# Altium schematic sheet sensorTest.SchDoc
size B
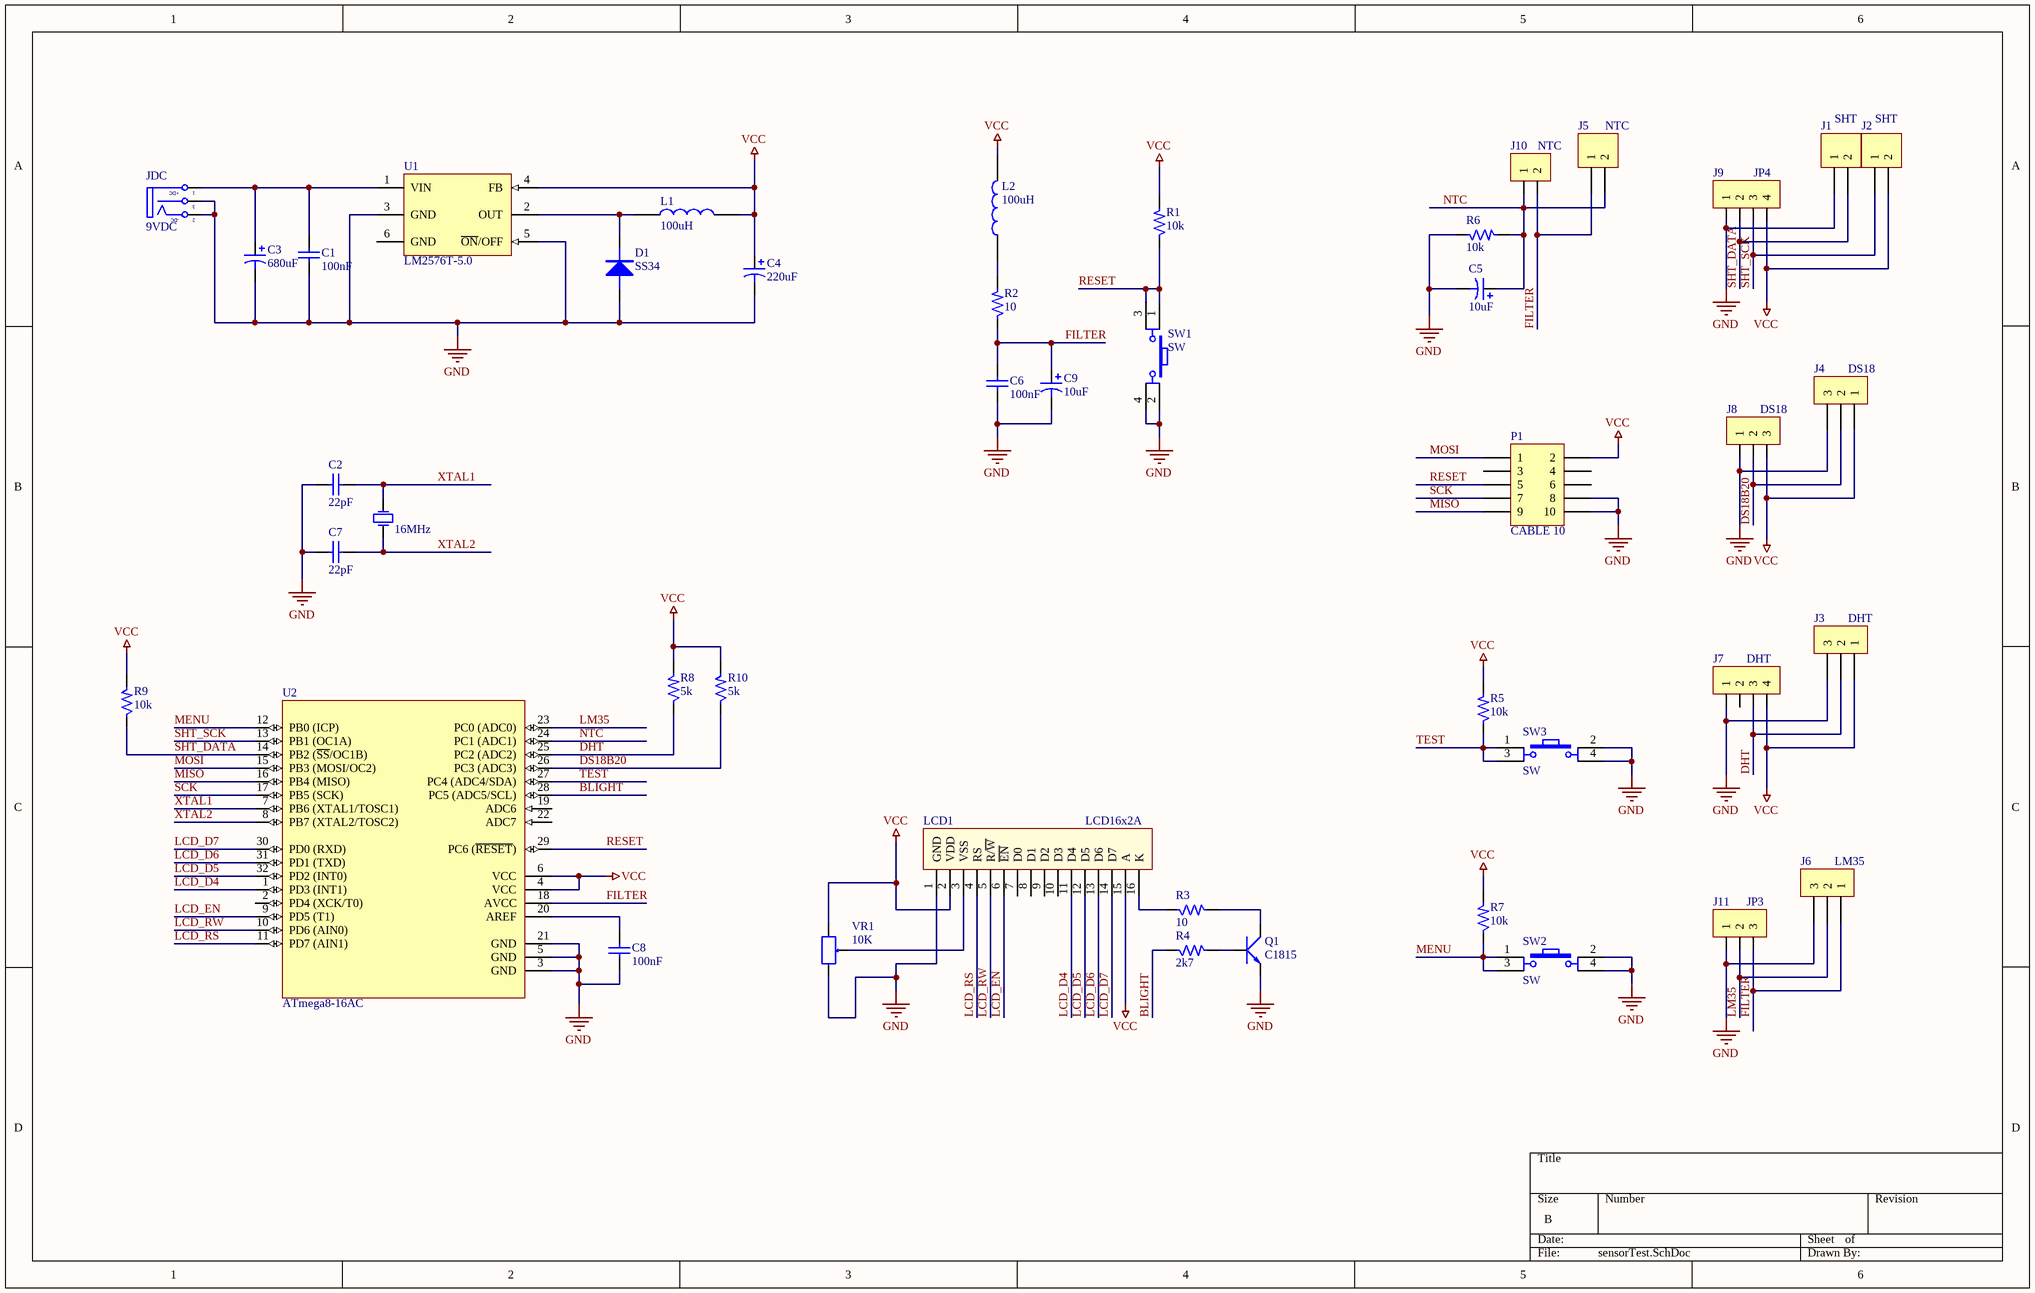
[diagram p0: sensorTest.SchDoc]

## Parts
C1  100nF  [Tu 0805]
C2  22pF  [Tu 0805]
C3  680uF  [C10mm]
C4  220uF  [C10mm]
C5  10uF  [C5mm]
C6  100nF  [Tu 0805]
C7  22pF  [Tu 0805]
C8  100nF  [Tu 0805]
C9  10uF  [C5mm]
D1  SS34  [SMB]
J1  SHT  [KF2-5.08]
J2  SHT  [KF2-5.08]
J3  DHT  [KF3-5.08]
J4  DS18  [KF3-5.08]
J5  NTC  [KF2-5.08]
J6  LM35  [KF3-5.08]
J7  DHT  [JP4-C1T]
J8  DS18  [JP3-C1T]
J9  JP4  [JP4-C1T]
J10  NTC  [JP2-C1T]
J11  JP3  [JP3-C1T]
JDC  9VDC  [DC-IN]
L1  100uH  [Cuon Cam 7.5x7x5]
L2  100uH  [Cuon Cam 7.5x7x5]
LCD1  LCD16x2A  [LCD16X2]
P1  CABLE 10  [CABLE 10]
Q1  C1815  [SOT23B]
R1  10k  [Tro SMD 0805]
R2  10  [Tro SMD 0805]
R3  10  [Tro SMD 0805]
R4  2k7  [Tro SMD 0805]
R5  10k  [Tro SMD 0805]
R6  10k  [Tro SMD 0805]
R7  10k  [Tro SMD 0805]
R8  5k  [Tro SMD 0805]
R9  10k  [Tro SMD 0805]
R10  5k  [Tro SMD 0805]
SW1  SW  [SW4]
SW2  SW  [SW4]
SW3  SW  [SW4]
U1  LM2576T-5.0  [LM2576SSMD]
U2  ATmega8-16AC  [32A_L]
VR1  10K  [VR]
Y1  16MHz  [XT2]

## Nets
GND: C1.1 C2.1 C3.2 C4.2 C5.2 C6.1 C7.1 C8.1 C9.2 D1.1 J1.1 J3.3 J4.3 J6.3 J7.1 J8.1 J9.1 J11.1 JDC.2(TN) JDC.3(S) LCD1.1(GND) P1.8 P1.10 Q1.1(E) R6.1 SW1.2 SW1.4 SW2.2 SW2.4 SW3.2 SW3.4 U1.3(GND) U1.5(~{ON}/OFF) U2.3(GND) U2.5(GND) U2.21(GND) VR1.3
VCC: C4.1 J2.2 J3.1 J4.1 J7.4 J8.3 J9.4 L1.2 L2.2 LCD1.2(VDD) LCD1.15(A) P1.2 R1.2 R5.2 R7.2 R8.2 R9.2 R10.2 U1.4(FB) U2.4(VCC) U2.6(VCC) VR1.1
BLIGHT: R4.1 U2.28(PC5_(ADC5/SCL))
DHT: J3.2 J7.3 R8.1 U2.25(PC2_(ADC2))
DS18B20: J4.2 J8.2 R10.1 U2.26(PC3_(ADC3))
FILTER: C6.2 C9.1 J5.1 J6.1 J10.2 J11.3 R2.1 U2.18(AVCC)
LCD_D4: LCD1.11(D4) U2.1(PD3_(INT1))
LCD_D5: LCD1.12(D5) U2.32(PD2_(INT0))
LCD_D6: LCD1.13(D6) U2.31(PD1_(TXD))
LCD_D7: LCD1.14(D7) U2.30(PD0_(RXD))
LCD_EN: LCD1.6(~{EN}) U2.9(PD5_(T1))
LCD_RS: LCD1.4(RS) U2.11(PD7_(AIN1))
LCD_RW: LCD1.5(R/~{W}) U2.10(PD6_(AIN0))
LM35: J6.2 J11.2 U2.23(PC0_(ADC0))
MENU: R7.1 SW2.1 SW2.3 U2.12(PB0_(ICP))
MISO: P1.9 U2.16(PB4_(MISO))
MOSI: P1.1 U2.15(PB3_(MOSI/OC2))
NTC: C5.1 J5.2 J10.1 R6.2 U2.24(PC1_(ADC1))
RESET: P1.5 R1.1 SW1.1 SW1.3 U2.29(PC6_(~{RESET}))
SCK: P1.7 U2.17(PB5_(SCK))
SHT_DATA: J1.2 J9.2 R9.1 U2.14(PB2_(~{SS}/OC1B))
SHT_SCK: J2.1 J9.3 U2.13(PB1_(OC1A))
TEST: R5.1 SW3.1 SW3.3 U2.27(PC4_(ADC4/SDA))
XTAL1: C2.2 U2.7(PB6_(XTAL1/TOSC1)) Y1.2(OSC2)
XTAL2: C7.2 U2.8(PB7_(XTAL2/TOSC2)) Y1.1(OSC1)
NetC1_2: C1.2 C3.1 JDC.1(T) U1.1(VIN)
NetC8_2: C8.2 U2.20(AREF)
NetD1_2: D1.2 L1.1 U1.2(OUT)
NetL2_1: L2.1 R2.2
NetLCD1_3: LCD1.3(VSS) VR1.2
NetLCD1_16: LCD1.16(K) R3.1
NetQ1_2: Q1.2(C) R3.2
NetQ1_3: Q1.3(B) R4.2

Not connected (* = marked no-connect by the designer): J7 2; LCD1 7(D0) 8(D1) 9(D2) 10(D3); P1 3 4 6; U1 6(GND); U2 2(PD4_(XCK/T0)) 19(ADC6) 22(ADC7)

## Notes on the sheet
- (in symbol DCIN) +DC; -DC

## Library data of the parts
C1 C6-C8 = CAP 0805
C2 = Tu 0805
C3 C4 = Cap Pol 12mm: Polarized Capacitor (Axial); Published: 8-Jun-2000; LatestRevisionDate: 17-Jul-2002; LatestRevisionNote: Re-released for DXP Platform.; PackageReference: POLAR0.8; Publisher: Altium Limited
C5 C9 = Cap Pol 5mm: Polarized Capacitor (Axial); Published: 8-Jun-2000; LatestRevisionDate: 17-Jul-2002; LatestRevisionNote: Re-released for DXP Platform.; PackageReference: POLAR0.8; Publisher: Altium Limited
D1 = Diode SS34 3A 40V SMA ( 1N5822 SS34A)_MH: Diode SS34 3A 40V SMA ( 1N5822 SS34A)
J1 J2 J5 = KF2: Manufacturer: Würth Elektronik eiSos GmbH; partNo: 691103110002; ComponentLink1 Description: Manufacturer; ComponentLink2 Description: Datasheet; NoPins: 2; Created Date: 29 October 2013; ComponentLink1URL: http://www.we-online.com; ComponentLink2URL: http://katalog.we-online.de/em/datasheet/6911031100xx.pdf; Created by: Karrer Zheng
J3 J4 J6 = KF3: Manufacturer: Würth Elektronik eiSos GmbH; partNo: 691103110003; ComponentLink1 Description: Manufacturer; ComponentLink2 Description: Datasheet; NoPins: 3; Created Date: 29 October 2013; ComponentLink1URL: http://www.we-online.com; ComponentLink2URL: http://katalog.we-online.de/em/datasheet/6911031100xx.pdf; Created by: Karrer Zheng
J7 J9 = JP4: WR-PHD 2.54 mm Angled Socket Header; Manufacturer: W¨¹rth Elektronik eiSos GmbH; partNo: 613004143121; ComponentLink1 Description: Manufacturer; ComponentLink2 Description: Datasheet; NoPins: 04; Created Date: 29 March 2013; ComponentLink1URL: http://www.we-online.com; ComponentLink2URL: http://katalog.we-online.de/em/datasheet/6130xx143121.pdf; Created by: Karrer Zheng
J8 J11 = JP3: WR-PHD 2.54 mm Angled Socket Header; Manufacturer: W¨¹rth Elektronik eiSos GmbH; partNo: 613003143121; ComponentLink1 Description: Manufacturer; ComponentLink2 Description: Datasheet; NoPins: 03; Created Date: 29 March 2013; ComponentLink1URL: http://www.we-online.com; ComponentLink2URL: http://katalog.we-online.de/em/datasheet/6130xx143121.pdf; Created by: Karrer Zheng
J10 = JP2: WR-PHD 2.54 mm Angled Socket Header; Manufacturer: W¨¹rth Elektronik eiSos GmbH; partNo: 613002143121; ComponentLink1 Description: Manufacturer; ComponentLink2 Description: Datasheet; NoPins: 02; Created Date: 29 March 2013; ComponentLink1URL: http://www.we-online.com; ComponentLink2URL: http://katalog.we-online.de/em/datasheet/6130xx143121.pdf; Created by: Karrer Zheng
JDC = DCIN: Jac DC input; Value: Jac DC
L1 L2 = CUON CAM 100uH_SMD: Dán; Don_Vi: Con; Ma_Hang: MH003999; Ten_Linh_Kien: Cuộn Cảm 100uH 7x7x4MM CD74; Ma_Hang: *; Kieu_Chan: *; Chung_Loai: Dán
LCD1 = LCD16x2: LCD dipslay 16 char, 2 line; Value: LCD16x2A
P1 = CABLE 10: Header, 5-Pin, Dual row; LatestRevisionDate: 17-Jul-2002; LatestRevisionNote: Re-released for DXP Platform.; Publisher: Altium Limited
Q1 = C1815: NPN 600mW, ECB; Value: C1815
R1-R10 = Res: Resistor 1/4W; Value: R1/4W - 1K
SW1-SW3 = SW4: Switch button 4 pin; Value: Button chip 4 pin
U1 = LM2576T-5.0: SIMPLE SWITCHER; 3A Step-Down Voltage Regulator; Manufacturer: National Semiconductor; PackageTopMarking: NSUZXYTT*LM2576T*-5.0 P+; PowerWise: N; FirstPublished: 4-Dec-2008; DatasheetVersion: Aug-2004; PackageVersion: revJ, Jan-1992; PackageReference: T05A; Publisher: Altium Limited; PackageDescription: TO-220, Molded, 5 Lead, Straight; CompType: Switcher; PartNumber: LM2576T-5.0; RoHS: O; PinCount: 5; DigiKeyPartNumber: LM2576T-5.0-ND; Code_JEDEC: TO-220-AB; ComponentLink1Description: LM2576 Datasheet; ComponentLink1URL: http://www.national.com/ds/LM/LM2576.pdf; ComponentLink2Description: LM2576 Web Page; ComponentLink2URL: http://www.national.com/pf/LM/LM2576.html; ComponentLink3Description: T05A Package Page; ComponentLink3URL: http://www.national.com/packaging/folders/t05a.html
U2 = ATmega8-16AC: 8-Bit AVR Microcontroller with 8K Bytes of In-System Programmable Flash Memory; Published: 17-Sep-2003; LatestRevisionDate: 13-Apr-2006; LatestRevisionNote: IPC-7351 Footprint Added.; DatasheetVersion: 2486H-AVR-09/02; PackageVersion: revB, Oct-2001; PackageReference: 32A; Publisher: Altium Limited; PackageDescription: 32-Pin Thin Quad Flat Pack 0.8 mm Pitch; Code_JEDEC: MS-026-ABA; ComponentLink1Description: Manufacturer Link; ComponentLink1URL: http://www.atmel.com; ComponentLink2Description: Datasheet; ComponentLink2URL: http://www.atmel.com/dyn/resources/prod_documents/doc2486.pdf
VR1 = VR: Var Resistor; Value: VR 10K
Y1 = Crystal: Crystal Oscillator; Published: 8-Jun-2000; LatestRevisionDate: 17-Jul-2002; LatestRevisionNote: Re-released for DXP Platform.; PackageReference: R38; Publisher: Altium Limited